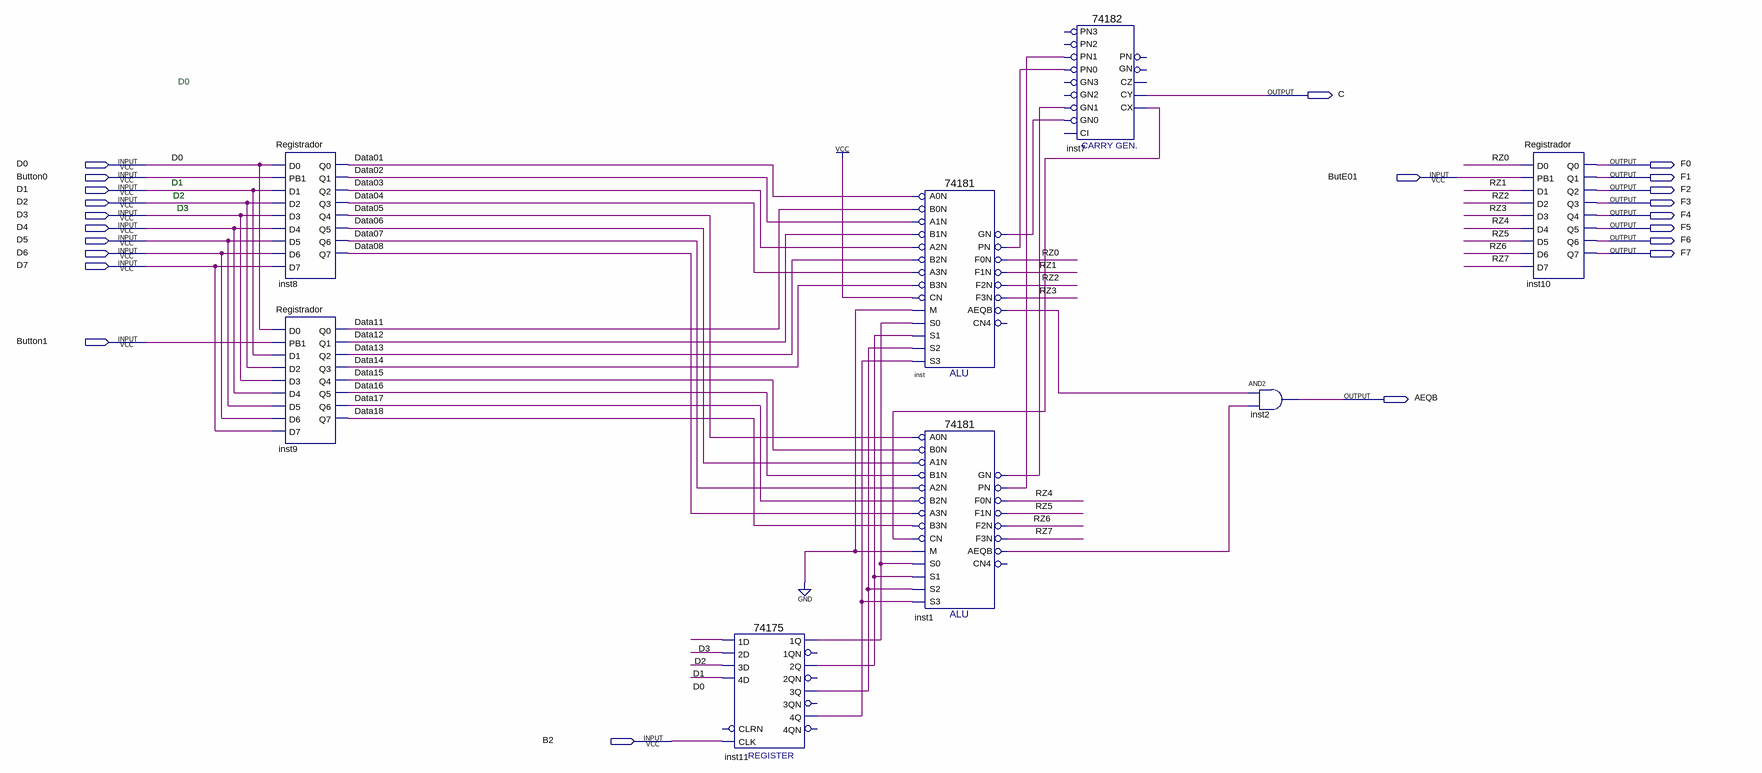
[diagram p0: schematic sheet]
// Quartus schematic ULAquefunciona.bdf as structural Verilog: 8 symbols, 22 pins
module ULAquefunciona (
  input  D0,
  input  Button0,
  input  ButE01,
  input  D1,
  input  D2,
  input  D3,
  input  D4,
  input  D5,
  input  D6,
  input  D7,
  input  Button1,
  input  B2,
  output C,
  output F0,
  output F1,
  output F2,
  output F3,
  output F4,
  output F5,
  output F6,
  output F7,
  output AEQB
);

  wire Data01, Data02, Data03, Data04, Data05, Data06, Data07, Data08, Data11, Data12, Data13, Data14,
       Data15, Data16, Data17, Data18, inst1_aeqb, inst1_gn, inst1_pn, inst7_cx, inst11_1q, inst11_2q,
       inst11_3q, inst11_4q, inst_aeqb, inst_gn, inst_pn, RZ0, RZ1, RZ2, RZ3, RZ4, RZ5, RZ6, RZ7;

  Registrador inst8 (
    .D0(D0), .PB1(Button0), .D1(D1), .D2(D2), .D3(D3), .D4(D4), .D5(D5), .D6(D6), .D7(D7), .Q0(Data01),
    .Q1(Data02), .Q2(Data03), .Q3(Data04), .Q4(Data05), .Q5(Data06), .Q6(Data07), .Q7(Data08));
  Registrador inst9 (
    .D0(D0), .PB1(Button1), .D1(D1), .D2(D2), .D3(D3), .D4(D4), .D5(D5), .D6(D6), .D7(D7), .Q0(Data11),
    .Q1(Data12), .Q2(Data13), .Q3(Data14), .Q4(Data15), .Q5(Data16), .Q6(Data17), .Q7(Data18));
  \74175  inst11 (
    .CLK(B2), .\3D (D1), .\2D (D2), .\1D (D3), .\4D (D0), .\1Q (inst11_1q), .\3Q (inst11_3q),
    .\2Q (inst11_2q), .\4Q (inst11_4q));  // open: CLRN, 1QN, 2QN, 4QN, 3QN
  \74181  inst (
    .B0N(Data11), .A0N(Data01), .A1N(Data02), .B1N(Data12), .A3N(Data04), .B2N(Data13), .A2N(Data03),
    .M(1'b0), .CN(1'b1), .B3N(Data14), .S2(inst11_3q), .S1(inst11_2q), .S0(inst11_1q), .S3(inst11_4q),
    .PN(inst_pn), .GN(inst_gn), .F3N(RZ3), .F1N(RZ1), .F0N(RZ0), .AEQB(inst_aeqb), .F2N(RZ2));  // open: CN4
  \74181  inst1 (
    .B0N(Data15), .A0N(Data05), .A1N(Data06), .B1N(Data16), .A3N(Data08), .B2N(Data17), .A2N(Data07),
    .M(1'b0), .CN(inst7_cx), .B3N(Data18), .S2(inst11_3q), .S1(inst11_2q), .S0(inst11_1q), .S3(inst11_4q),
    .PN(inst1_pn), .GN(inst1_gn), .F3N(RZ7), .F1N(RZ5), .F0N(RZ4), .AEQB(inst1_aeqb), .F2N(RZ6));  // open: CN4
  \74182  inst7 (
    .PN1(inst1_pn), .PN0(inst_pn), .GN1(inst1_gn), .GN0(inst_gn), .CY(C), .CX(inst7_cx));  // open: PN2, GN2, GN3, PN3, CI, PN, CZ, GN
  and inst2 (AEQB, inst_aeqb, inst1_aeqb);
  Registrador inst10 (
    .D0(RZ0), .PB1(ButE01), .D1(RZ1), .D2(RZ2), .D3(RZ3), .D4(RZ4), .D5(RZ5), .D6(RZ6), .D7(RZ7), .Q0(F0),
    .Q1(F1), .Q2(F2), .Q3(F3), .Q4(F4), .Q5(F5), .Q6(F6), .Q7(F7));

  // Notes on the sheet:
  //   D0
  //   D1
  //   D2
  //   D3
endmodule
